# Altium schematic sheet GPS.SchDoc
size A4
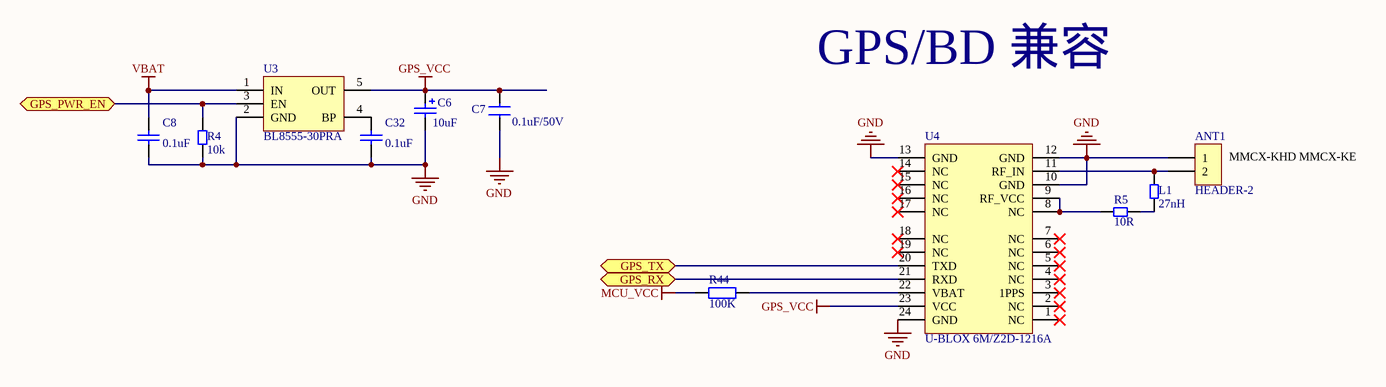
[diagram p0: GPS.SchDoc]

## Parts
ANT1  HEADER-2  [IPEX]
C6  10uF  [CAP1210]
C7  0.1uF/50V  [0603C]
C8  0.1uF  [0603C]
C32  0.1uF  [0603C]
L1  27nH  [0603R]
R4  10k  [0603R]
R5  10R  [1206R]
R44  100K  [0603R]
U3  BL8555-30PRA  [SOT23-5]
U4  U-BLOX 6M/Z2D-1216A  [G_UBLOXNEO5]

## Ports
GPS_PWR_EN, GPS_RX, GPS_TX

## Nets
GND: ANT1.1 C6.2 C7.2 C8.1 C32.1 R4.1 U3.2(GND) U4.10(GND) U4.12(GND) U4.13(GND) U4.24(GND)
GPS_VCC: C6.1 C7.1 U3.5(OUT) U4.23(VCC)
MCU_VCC: R44.1
VBAT: C8.2 U3.1(IN)
GPS_PWR_EN: R4.2 U3.3(EN) ; port GPS_PWR_EN
GPS_RX: U4.21(RXD) ; port GPS_RX
GPS_TX: U4.20(TXD) ; port GPS_TX
NetANT1_2: ANT1.2 L1.2 U4.11(RF_IN)
NetC32_2: C32.2 U3.4(BP)
NetL1_1: L1.1 R5.2
NetR5_1: R5.1 U4.8(NC) U4.9(RF_VCC)
NetR44_2: R44.2 U4.22(VBAT)

Not connected (* = marked no-connect by the designer): U4 1(NC)* 2(NC)* 3(1PPS)* 4(NC)* 5(NC)* 6(NC)* 7(NC)* 14(NC)* 15(NC)* 16(NC)* 17(NC)* 18(NC)* 19(NC)*

## Notes on the sheet
- GPS/BD 兼容
- (near ANT1) MMCX-KHD MMCX-KE

## Library data of the parts
C6 = Cap Pol: Polarized Capacitor (Radial); Published: 8-Jun-2000; LatestRevisionDate: 17-Jul-2002; LatestRevisionNote: Re-released for DXP Platform.; Publisher: Altium Limited; Value: 10uF
C7 = CAP
C8 C32 = Cap: Capacitor; Value: 104; Published: 8-Jun-2000; LatestRevisionDate: 17-Jul-2002; LatestRevisionNote: Re-released for DXP Platform.; Publisher: Altium Limited
L1 R4 R5 = Res2: Resistor; Value: 1K; Published: 8-Jun-2000; LatestRevisionDate: 17-Jul-2002; LatestRevisionNote: Re-released for DXP Platform.; Publisher: Altium Limited
R44 = 0603R
U3 = SGM2019
U4 = XBDM-1612